# EAGLE board OpenBook_Reader (EAGLE 9.7.0)
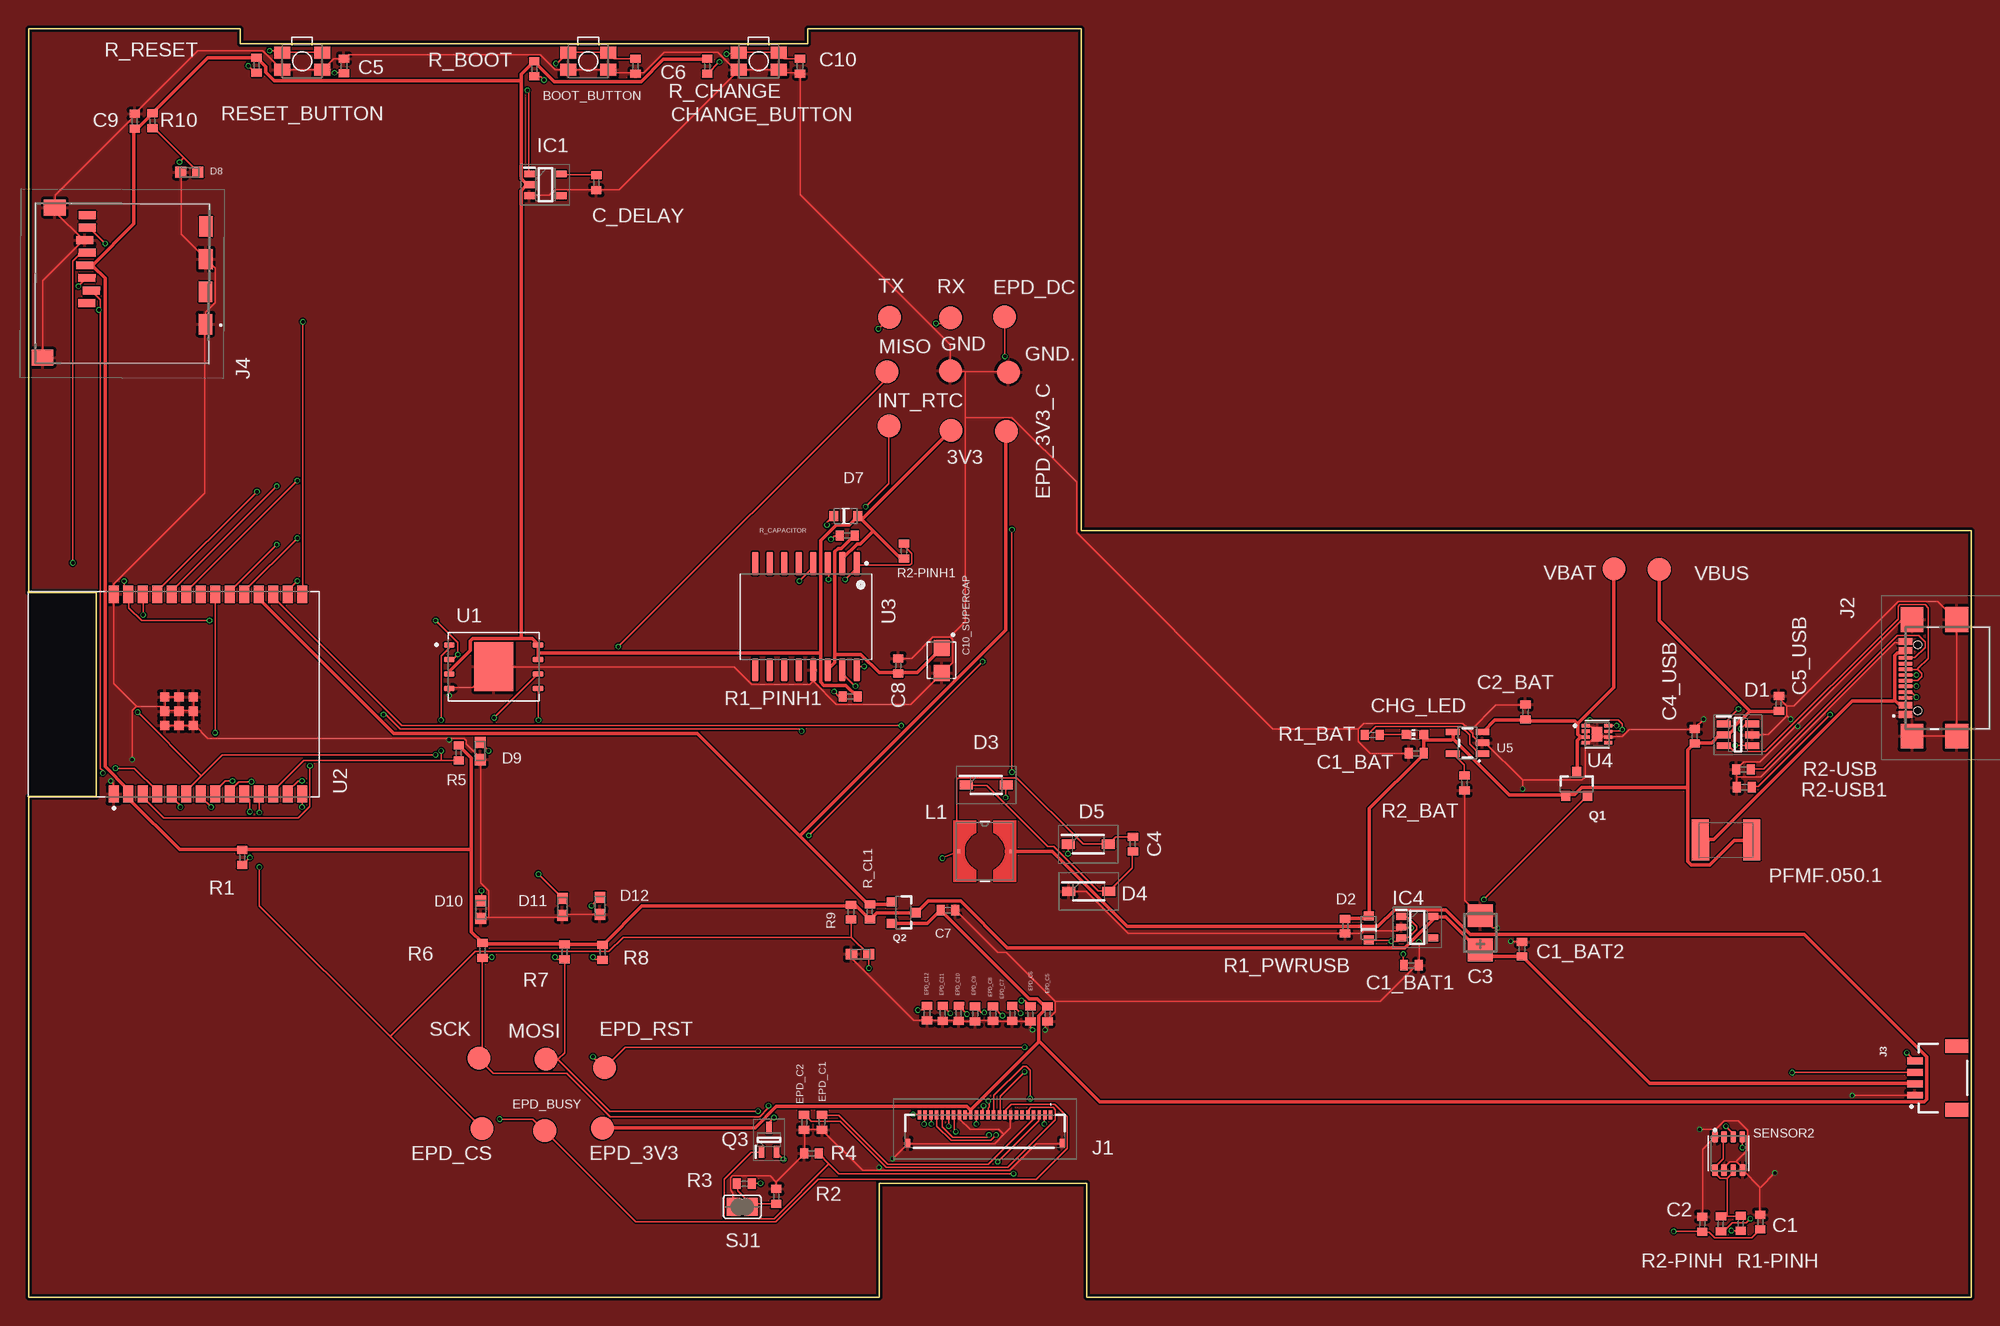
[diagram p1: board, top side]
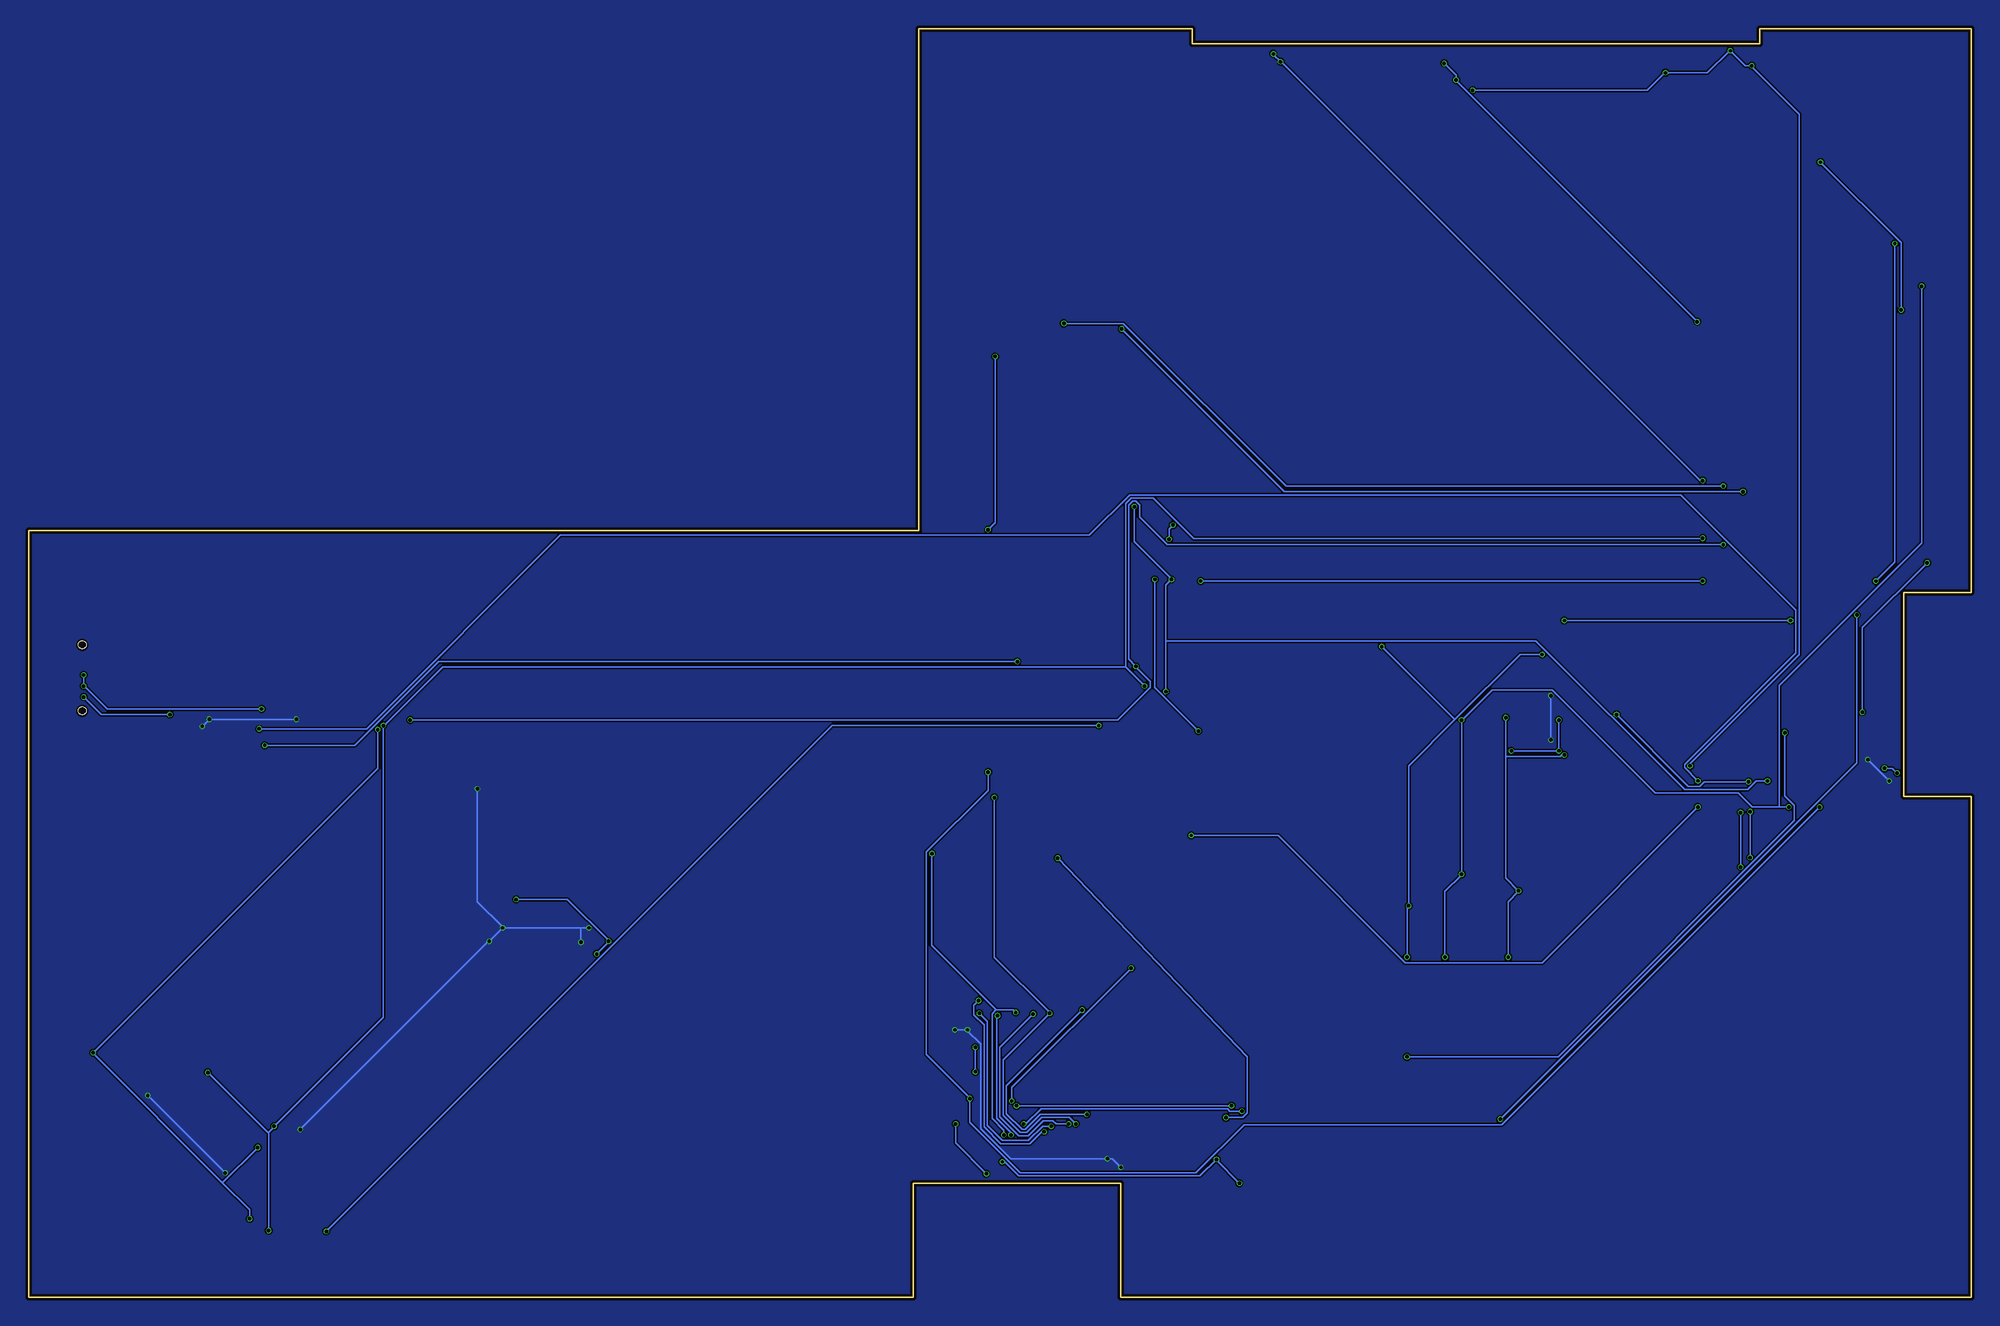
[diagram p2: board, bottom side, seen from below]

Size 170.2 x 111.2 mm. Coordinates in mm from the lower left corner, seen from the top.
Outline: 0,111.2 0,61.76 5.95,61.76 5.95,43.89 0,43.89 0,0 74.52,0 74.52,10 92.72,10 92.72,0 170.2,0 170.2,67.2 92.2,67.2 92.2,111.2 68.28,111.2 68.28,109.88 18.55,109.88 18.55,111.2 0,111.2
Copper layers (1*16): Top 0.035mm / dielectric 1.6mm / Bottom 0.035mm
Design rules "jlcpcb-2layers.dru *": minimum track width 0.15mm, minimum drill 0.3mm, track to track 5mil, track to pad 5mil, pad to pad 5mil, via to via 5mil, smd to smd 5mil, copper to edge 0.2mm, drill to drill 6mil, minimum pad ring 10mil, minimum via ring 3mil, stop-mask expansion 4mil, vias tented up to drill 0mil, thermal gap 10mil
Net classes: 1 Power: width 0.3 mm

## Footprints (pad centres in the part's own frame; a part is rotated, then mirrored left to right if it is on the bottom)
TP20R = smd 2 x 2: TP 0,0
MYBUTTON = smd 1.4 x 1.05: 1 1.75,0.75; 2 -1.75,0.75; 3 -1.75,-0.75; 4 1.75,-0.75
EAGLE-LTSPICE_C0402 = smd 0.7 x 0.9: 1 -0.65,0; 2 0.65,0
RCL_CT3528 = smd 2 x 2.2: + -1.5,0; - 1.5,0
CAPCP3225X100N = smd 1.4 x 1.4: 1 -1.1,0; 2 1.1,0
ADAFRUIT_CHIP-LED0603 = smd 0.8 x 0.8: A 0,-0.75; C 0,0.75
SOT95P280X145-6N = smd 1.2 x 0.6: 1 -1.25,0.95; 2 -1.25,0; 3 -1.25,-0.95; 4 1.25,-0.95; 5 1.25,0; 6 1.25,0.95
ESP32_WROVER_AVX---SD0805S020S1R0_AVX_SD0805S020S1R0_0 = smd 0.8 x 0.9: 1 -1.05,0; 2 1.05,0
SOD3716X135N = smd 1.15 x 0.8: 1 -1.75,0; 2 1.75,0
DIOC1608X36N = smd 0.97 x 0.94: 1 -0.75,0; 2 0.75,0
SOT95P280X125-5N = smd 0.9 x 0.6: 1 -1.4,0.95; 2 -1.4,0; 3 -1.4,-0.95; 4 1.4,-0.95; 5 1.4,0.95
SOT95P280X120-5N = smd 0.9 x 0.6: 1 -1.4,0.95; 2 -1.4,0; 3 -1.4,-0.95; 4 1.4,-0.95; 5 1.4,0.95
FH34SRJ24S05SH99 = smd 0.3 x 0.8: 1 5.75,1.45; 2 5.25,1.45; 3 4.75,1.45; 4 4.25,1.45; 5 3.75,1.45; 6 3.25,1.45; 7 2.75,1.45; 8 2.25,1.45; 9 1.75,1.45; 10 1.25,1.45; 11 0.75,1.45; 12 0.25,1.45; 13 -0.25,1.45; 14 -0.75,1.45; 15 -1.25,1.45; 16 -1.75,1.45; 17 -2.25,1.45; 18 -2.75,1.45; 19 -3.25,1.45; 20 -3.75,1.45; 21 -4.25,1.45; 22 -4.75,1.45; 23 -5.25,1.45; 24 -5.75,1.45 | smd 0.4 x 0.8: MP1 6.75,-1.05; MP2 -6.75,-1.05
SAMACSYS_PARTS_USB4110GFA = smd 0.3 x 1.15: A1 -3.35,3.678; A4 -2.55,3.678; A5 -1.25,3.678; A6 -0.25,3.678; A7 0.25,3.678; A8 1.25,3.678; A9 2.55,3.678; A12 3.35,3.678; B1 3.05,3.678; B4 2.25,3.678; B5 1.75,3.678; B6 0.75,3.678; B7 -0.75,3.678; B8 -1.75,3.678; B9 -2.25,3.678; B12 -3.05,3.678 | smd 2.18 x 2: MP1 -5.11,-0.827; MP2 5.11,-0.827; MP3 -5.11,3.103; MP4 5.11,3.103 | hole 0.65: -2.89,2.603; 2.89,2.603
JST04_1MM_RA = smd 0.6 x 1.35: 1 -1.5,0; 2 -0.5,0; 3 0.5,0; 4 1.5,0 | smd 1.2 x 2: NC1 2.8,-3.675; NC2 -2.8,-3.675
112ATAARR03ATTEND = smd 1.8 x 1.2: G1 10.6,10.4; G2 4.9,10.4; S1 7.75,10.4; S2 2.05,10.4 | smd 1.4 x 1.9: G3 13.6,-3.85; G4 0.45,-2.85 | smd 0.7 x 1.5: P1 8.8,0; P2 7.7,0.4; P3 6.6,0; P4 5.5,-0.2; P5 4.4,0; P6 3.3,-0.2; P7 2.2,0; P8 1.1,0
IND_4828-WE-TPC_WRE = smd 0.305 x 0.305: 1 -2.286,0; 2 2.286,0
ESP32C6_VARISTOR_CT/CN1812 = smd 1.5 x 3.6: 1 -2.25,0; 2 2.25,0
ESP32_WROVER_SPARKFUN-DISCRETESEMI_SOT23-3 = smd 0.8 x 0.9: 1 -0.95,-1; 2 0.95,-1; 3 0,1.1
SOT65P210X110-3N = smd 1.05 x 0.5: 1 -1.05,0.65; 2 -1.05,-0.65; 3 1.05,0
ESP32_WROVER_EAGLE-LTSPICE_R0402 = smd 0.7 x 0.9: 1 -0.65,0; 2 0.65,0
ESP32_WROVER_BME680_PSON80P300X300X100-8N = smd 1.016 x 0.5: 1 1.458,1.2; 2 1.458,0.4; 3 1.458,-0.4; 4 1.458,-1.2; 5 -1.458,-1.22; 6 -1.458,-0.4; 7 -1.458,0.4; 8 -1.458,1.2
SJ = smd 1.168 x 1.6: 1 -0.762,0; 2 0.762,0
SON127P600X800X80-9N = smd 0.94 x 0.44: 1 -3.895,1.905; 2 -3.895,0.635; 3 -3.895,-0.635; 4 -3.895,-1.905; 5 3.895,-1.905; 6 3.895,-0.635; 7 3.895,0.635; 8 3.895,1.905 | smd 3.4 x 4.3: 9 0,0
XCVR_ESP32-C6-WROOM-1-N8 = smd 1.5 x 0.9: 1 -8.75,5.26; 2 -8.75,3.99; 3 -8.75,2.72; 4 -8.75,1.45; 5 -8.75,0.18; 6 -8.75,-1.09; 7 -8.75,-2.36; 8 -8.75,-3.63; 9 -8.75,-4.9; 10 -8.75,-6.17; 11 -8.75,-7.44; 12 -8.75,-8.71; 13 -8.75,-9.98; 14 -8.75,-11.25; 15 8.75,-11.25; 16 8.75,-9.98; 17 8.75,-8.71; 18 8.75,-7.44; 19 8.75,-6.17; 20 8.75,-4.9; 21 8.75,-3.63; 22 8.75,-2.36; 23 8.75,-1.09; 24 8.75,0.18; 25 8.75,1.45; 26 8.75,2.72; 27 8.75,3.99; 28 8.75,5.26 | smd 0.8 x 0.8: 29_1 -2.755,0.79; 29_2 -1.505,0.79; 29_3 -0.255,0.79; 29_4 -2.755,-0.46; 29_5 -1.505,-0.46; 29_6 -0.255,-0.46; 29_7 -2.755,-1.71; 29_8 -1.505,-1.71; 29_9 -0.255,-1.71
SOIC127P1032X265-16N = smd 2.05 x 0.59: 1 -4.655,4.445; 2 -4.655,3.175; 3 -4.655,1.905; 4 -4.655,0.635; 5 -4.655,-0.635; 6 -4.655,-1.905; 7 -4.655,-3.175; 8 -4.655,-4.445; 9 4.655,-4.445; 10 4.655,-3.175; 11 4.655,-1.905; 12 4.655,-0.635; 13 4.655,0.635; 14 4.655,1.905; 15 4.655,3.175; 16 4.655,4.445
SON50P200X200X80-9N = smd 0.76 x 0.27: 1 -0.985,0.75; 4 -0.985,-0.75; 5 0.985,-0.75; 6 0.985,-0.25; 7 0.985,0.25; 8 0.985,0.75 | smd 0.76 x 0.3: 2 -0.985,0.25; 3 -0.985,-0.25 | smd 0.9 x 1.3: 9 0,0
ESP32_WROVER_SPARKFUN-IC-POWER_SOT23-5 = smd 0.55 x 1.2: 1 -0.95,-1.3; 2 0,-1.3; 3 0.95,-1.3; 4 0.95,1.3; 5 -0.95,1.3

## Placement (x,y rotation side)
3V3  TPTP20R  [TP20R]  80.81,75.97 0 top
BOOT_BUTTON  BUTTON_CUSYOMV1  [MYBUTTON]  49.03,108.32 180 top
C1  100nF  [EAGLE-LTSPICE_C0402]  151.69,6.61 90 top
C1_BAT  4.7uF  [EAGLE-LTSPICE_C0402]  121.57,47.69 180 top
C1_BAT1  4.7uF  [EAGLE-LTSPICE_C0402]  121.14,29.12 0 top
C1_BAT2  4.7uF  [EAGLE-LTSPICE_C0402]  130.83,30.52 90 top
C2  100nF  [EAGLE-LTSPICE_C0402]  146.61,6.43 90 top
C2_BAT  4.7uF  [EAGLE-LTSPICE_C0402]  131.13,51.3 90 top
C3  100uF TANT  [RCL_CT3528]  127.17,31.96 90 top
C4  4.7uF/25V  [EAGLE-LTSPICE_C0402]  96.74,39.73 90 top
C4_USB  100nF  [EAGLE-LTSPICE_C0402]  145.96,49.19 90 top
C5  1uF  [EAGLE-LTSPICE_C0402]  27.63,107.92 90 top
C5_USB  4.7uF  [EAGLE-LTSPICE_C0402]  153.33,52.05 90 top
C6  100nF  [EAGLE-LTSPICE_C0402]  53.17,107.89 270 top
C7  10uF  [EAGLE-LTSPICE_C0402]  80.54,33.95 0 top
C8  100nF  [EAGLE-LTSPICE_C0402]  76.18,55.34 90 top
C9  100nF  [EAGLE-LTSPICE_C0402]  9.31,103.08 90 top
C10  100nF  [EAGLE-LTSPICE_C0402]  67.58,107.89 270 top
C10_SUPERCAP  CPH3225A  [CAPCP3225X100N]  79.99,55.83 270 top
C_DELAY  100nF  [EAGLE-LTSPICE_C0402]  49.74,97.69 269.6 top
CHANGE_BUTTON  BUTTON_CUSYOMV1  [MYBUTTON]  63.96,108.32 180 top
CHG_LED  [ADAFRUIT_CHIP-LED0603]  121.46,49.34 90 top
D1  USBLC6-2SC6Y  [SOT95P280X145-6N]  149.75,49.3 0 top
D2  ESP32_WROVER_AVX---SD0805S020S1R0_AVX_SD0805S020S1R0_0_0AVX_SD0805S020S1R0_0_0  [ESP32_WROVER_AVX---SD0805S020S1R0_AVX_SD0805S020S1R0_0]  117.4,32.39 90 top
D3  MBR0530  [SOD3716X135N]  83.89,44.91 0 top
D4  MBR0530  [SOD3716X135N]  92.88,35.59 0 top
D5  MBR0530  [SOD3716X135N]  92.83,39.73 0 top
D6  PGB1010603MR  [DIOC1608X36N]  72.84,30.09 0 top
D7  ESP32_WROVER_AVX---SD0805S020S1R0_AVX_SD0805S020S1R0_0_0AVX_SD0805S020S1R0_0_0  [ESP32_WROVER_AVX---SD0805S020S1R0_AVX_SD0805S020S1R0_0]  71.6,68.47 0 top
D8  PGB1010603MR  [DIOC1608X36N]  14.07,98.61 0 top
D9  PGB1010603MR  [DIOC1608X36N]  39.56,47.88 90 top
D10  PGB1010603MR  [DIOC1608X36N]  39.61,33.98 90 top
D11  PGB1010603MR  [DIOC1608X36N]  46.77,34.23 90 top
D12  PGB1010603MR  [DIOC1608X36N]  50.05,34.33 90 top
EPD_3V3  TPTP20R  [TP20R]  50.26,14.83 0 top
EPD_3V3_C  TPTP20R  [TP20R]  85.65,75.91 0 top
EPD_BUSY  TPTP20R  [TP20R]  45.22,14.62 0 top
EPD_C1  1uF/50V  [EAGLE-LTSPICE_C0402]  69.51,15.36 90 top
EPD_C2  1uF/50V  [EAGLE-LTSPICE_C0402]  67.94,15.36 90 top
EPD_C5  1uF/50V  [EAGLE-LTSPICE_C0402]  89.27,24.86 90 top
EPD_C6  1uF/50V  [EAGLE-LTSPICE_C0402]  87.76,24.84 90 top
EPD_C7  1uF/50V  [EAGLE-LTSPICE_C0402]  86.17,24.88 90 top
EPD_C8  1uF/50V  [EAGLE-LTSPICE_C0402]  84.49,24.88 90 top
EPD_C9  1uF/50V  [EAGLE-LTSPICE_C0402]  82.92,24.87 90 top
EPD_C10  1uF/50V  [EAGLE-LTSPICE_C0402]  81.49,24.9 89.2 top
EPD_C11  1uF/50V  [EAGLE-LTSPICE_C0402]  80.08,24.91 90 top
EPD_C12  1uF/50V  [EAGLE-LTSPICE_C0402]  78.71,24.91 90 top
EPD_CS  TPTP20R  [TP20R]  39.71,14.8 0 top
EPD_DC  TPTP20R  [TP20R]  85.51,85.95 0 top
EPD_RST  TPTP20R  [TP20R]  50.46,20.12 0 top
GND  TPTP20R  [TP20R]  80.76,81.22 0 top
GND.  TPTP20R  [TP20R]  85.84,81.08 0 top
IC1  BD5229G-TR  [SOT95P280X125-5N]  45.28,97.5 0 top
IC4  XC6220A331MR-G  [SOT95P280X120-5N]  121.65,32.45 0 top
INT_RTC  TPTP20R  [TP20R]  75.39,76.38 0 top
J1  FH34SRJ-24S-0.5SH_99_  [FH34SRJ24S05SH99]  83.79,14.55 0 top
J2  SAMACSYS_PARTS_USB4110-GF-A  [SAMACSYS_PARTS_USB4110GFA]  168.1,54.3 90 top
J3  QWIIC_RIGHT_ANGLE  [JST04_1MM_RA]  165.25,19.23 90 top
J4  112A-TAAR-R03_ATTEND  [112ATAARR03ATTEND]  5.15,95.95 269.7 top
L1  744043680IND_4828-WE-TPC_WRE  [IND_4828-WE-TPC_WRE]  83.77,39.11 0 top
MISO  TPTP20R  [TP20R]  75.22,81.12 0 top
MOSI  TPTP20R  [TP20R]  45.32,20.89 0 top
PFMF.050.1  ESP32C6_VARISTORCN1812  [ESP32C6_VARISTOR_CT/CN1812]  148.7,40.09 0.3 top
Q1  20V/4.2A/52mΩ/1.4W  [ESP32_WROVER_SPARKFUN-DISCRETESEMI_SOT23-3]  135.62,44.95 0 top
Q2  20V/4.2A/52mΩ/1.4W  [ESP32_WROVER_SPARKFUN-DISCRETESEMI_SOT23-3]  76.61,33.73 270 top
Q3  SI1308EDL-T1-GE3  [SOT65P210X110-3N]  64.86,13.82 90 top
R1  10K  [ESP32_WROVER_EAGLE-LTSPICE_R0402]  18.73,38.55 90 top
R1-PINH  10K  [ESP32_WROVER_EAGLE-LTSPICE_R0402]  149.98,6.5 90 top
R1_BAT  200  [ESP32_WROVER_EAGLE-LTSPICE_R0402]  117.71,49.29 0 top
R1_PINH1  10K  [ESP32_WROVER_EAGLE-LTSPICE_R0402]  71.97,52.66 0 top
R1_PWRUSB  100K  [ESP32_WROVER_EAGLE-LTSPICE_R0402]  115.33,32.53 90 top
R2  2.2  [ESP32_WROVER_EAGLE-LTSPICE_R0402]  65.5,8.86 270 top
R2-PINH  10K  [ESP32_WROVER_EAGLE-LTSPICE_R0402]  148.25,6.45 90 top
R2-PINH1  10K  [ESP32_WROVER_EAGLE-LTSPICE_R0402]  76.69,65.42 270 top
R2-USB  5K1  [ESP32_WROVER_EAGLE-LTSPICE_R0402]  150.23,46.28 180 top
R2-USB1  5k1  [ESP32_WROVER_EAGLE-LTSPICE_R0402]  150.31,44.72 0 top
R2_BAT  2K  [ESP32_WROVER_EAGLE-LTSPICE_R0402]  125.79,45.08 90 top
R3  0.47  [ESP32_WROVER_EAGLE-LTSPICE_R0402]  62.71,9.98 180 top
R4  10K  [ESP32_WROVER_EAGLE-LTSPICE_R0402]  68.59,12.62 180 top
R5  10K  [ESP32_WROVER_EAGLE-LTSPICE_R0402]  37.69,47.72 90 top
R6  10K  [ESP32_WROVER_EAGLE-LTSPICE_R0402]  39.77,30.41 90 top
R7  10K  [ESP32_WROVER_EAGLE-LTSPICE_R0402]  46.96,30.29 90 top
R8  10K  [ESP32_WROVER_EAGLE-LTSPICE_R0402]  50.29,30.25 90 top
R9  10K  [ESP32_WROVER_EAGLE-LTSPICE_R0402]  72.05,33.77 90 top
R10  10K  [ESP32_WROVER_EAGLE-LTSPICE_R0402]  10.85,103.11 90 top
R_BOOT  10K  [ESP32_WROVER_EAGLE-LTSPICE_R0402]  44.3,107.67 270 top
R_CAPACITOR  15  [ESP32_WROVER_EAGLE-LTSPICE_R0402]  71.71,66.78 0 top
R_CHANGE  10K  [ESP32_WROVER_EAGLE-LTSPICE_R0402]  59.46,107.89 270 top
R_CL1  10K  [ESP32_WROVER_EAGLE-LTSPICE_R0402]  73.7,33.8 90 top
R_RESET  10K  [ESP32_WROVER_EAGLE-LTSPICE_R0402]  19.98,107.98 270 top
RESET_BUTTON  BUTTON_CUSYOMV1  [MYBUTTON]  23.97,108.32 180 top
RX  TPTP20R  [TP20R]  80.77,85.84 0 top
SCK  TPTP20R  [TP20R]  39.45,20.96 0 top
SENSOR2  ESP32_WROVER_BME680_BME680  [ESP32_WROVER_BME680_PSON80P300X300X100-8N]  148.93,12.62 90 top
SJ1  [SJ]  62.52,7.95 0 top
TX  TPTP20R  [TP20R]  75.43,85.89 0 top
U1  W25Q512JVEIQ  [SON127P600X800X80-9N]  40.75,55.27 0 top
U2  ESP32-C6-WROOM-1-N8  [XCVR_ESP32-C6-WROOM-1-N8]  12.72,52.88 90 top
U3  DS3231SN#  [SOIC127P1032X265-16N]  68.1,59.66 270 top
U4  MAX17048G+T10  [SON50P200X200X80-9N]  137.4,49.36 0 top
U5  ESP32_WROVER_SPARKFUN-IC-POWER_MCP73831  [ESP32_WROVER_SPARKFUN-IC-POWER_SOT23-5]  126.06,48.61 90 top
VBAT  TPTP20R  [TP20R]  138.89,63.84 0 top
VBUS  TPTP20R  [TP20R]  142.85,63.8 0 top

## Tracks (layer width: path | path; a pad name or v marks a point on that pad's centre or on a via)
3V3
  Top 0.3: 43.14,57.73 44.11,57.73 44.6,57.25 U1.8 44.67,57.04 44.67,56.48 | 43.14,57.73 38.92,57.73 38.71,57.52 38.71,56.69 36.91,54.89 36.91,54.68 U1.3 | 44.67,56.48 44.67,55.93 U1.7 | 69.39,56.48 69.39,66.32 70.77,67.7 71.88,67.7 72.64,68.46 D7.2 72.78,68.4 72.99,68.19 | 69.39,56.48 69.39,53.92 69.67,53.65 71.61,53.65 72.57,52.67 R1_PINH1.2 | 72.99,68.19 73.99,67.18 | 73.99,67.18 76.38,64.79 76.66,64.79 R2-PINH1.2 | 72.99,68.19 80.75,75.94 3V3.TP | 73.99,67.18 72.85,66.04 72.57,66.04 71.33,64.79 71.33,64.38 U3.2 | 69.39,56.48 44.67,56.48 | 43.14,106.62 43.14,107.17 44.25,108.28 R_BOOT.1 44.39,108.21 46.05,106.55 53.67,106.55 55.61,108.49 59.42,108.49 R_CHANGE.1 | 43.14,106.62 43.14,98.03 43.63,97.55 43.84,97.55 IC1.2 43.56,97.41 43.14,97 43.14,57.73 | 5.61,90.49 4.99,90.49 J4.P4 | 5.61,90.49 9.21,94.09 9.21,102.33 C9.1 9.35,102.47 9.56,102.47 10.8,103.71 R10.2 10.94,103.85 15.72,108.63 19.94,108.63 R_RESET.1 20.08,108.56 20.77,107.87 20.77,107.38 21.54,106.62 43.14,106.62 | J3.2 165.23,18.74 142.03,18.74 130.95,29.82 C1_BAT2.1 130.81,29.89 127.77,29.89 127.28,30.38 C3.+ 127.14,30.52 127,30.52 124.17,33.36 123.06,33.36 IC4.5 122.99,33.22 122.99,33.08 120.56,30.65 85.73,30.65 81.65,34.74 78.81,34.74 77.84,33.77 Q2.3 77.7,33.7 74.31,33.7 73.82,33.22 R_CL1.1 73.68,33.15 72.44,34.39 72.09,34.39 R9.2 71.95,34.32 53.74,34.32 50.41,31 R8.2 50.28,30.93 47.02,30.93 R7.2 46.88,31 39.82,31 R6.2 39.68,31.14 38.78,32.04 38.78,39.24 | 38.78,39.24 38.78,47.27 37.74,48.31 R5.2 | 38.78,39.24 18.84,39.24 R1.2 18.7,39.24 13.23,39.24 8.79,43.67 8.79,44.09 U2.2 8.66,44.23 8.66,44.57 6.72,46.51 6.72,89.31 5.68,90.35 5.61,90.49
12C_PW
  Top 0.15: 148.82,7.11 149.93,7.11 R1-PINH.2 | 148.82,7.11 148.26,7.11 R2-PINH.2 | 148.82,10.43 148.19,10.43 147.78,10.85 147.78,11.12 SENSOR2.8 147.78,11.19 147.78,11.47 148.47,12.16 148.47,14.03 SENSOR2.2 | 148.82,10.43 149.3,10.92 149.3,11.12 SENSOR2.6 | 148.82,10.43 148.82,7.11
32KHZ  (via drill 0.3)
  Top 0.15: R2-PINH1.1 76.73,66.04 76.73,65.83 77.35,65.21 77.35,64.31 77.21,64.17 72.71,64.17 72.57,64.31 U3.1 72.71,64.1 v71.53,62.92 | v19.53,45.2 18.42,45.2 17.66,44.43 17.66,44.16 U2.9 | v31.09,51.08 31.3,51.08 32.55,49.84 67.52,49.84 v67.73,49.63
  Bottom 0.15: v19.53,45.2 23.41,45.2 23.82,44.78 24.79,44.78 v31.09,51.08 | v67.73,49.63 71.53,53.44 v71.53,62.92
DN  (via drill 0.3)
  Top 0.15: v165.37,53.58 164.47,53.58 J2.B7 | J2.A7 v165.37,54.55 | v149.79,51.57 148.54,50.32 D1.1
  Bottom 0.15: v165.37,54.55 v165.37,53.58 165.3,53.58 163.29,51.57 v149.79,51.57
DP
  Top 0.15: 165.51,55.03 165.85,54.68 165.85,54.41 165.51,54.06 164.47,54.06 J2.A6 | 165.51,55.03 164.47,55.03 J2.B6 | D1.3 148.54,48.31 148.96,48.31 149.44,47.83 152.14,47.83 163.78,59.46 163.78,60.57 163.91,60.71 166.13,60.71 166.41,60.43 166.41,56 165.51,55.1 165.51,55.03
EPD_3V3
  Top 0.3: Q2.2 75.62,32.8 78.74,32.8 79.84,33.91 C7.1 79.98,33.84 87.67,26.15 88.36,26.15 89.06,25.46 EPD_C5.2 89.26,25.46 88.5,24.7 88.5,22.41 | J1.16 82.06,16.04 82.48,16.04 J1.15 82.55,16.18 82.55,16.46 | 82.55,16.46 88.5,22.41 | EPD_3V3.TP 50.28,14.87 63.64,14.87 65.51,16.73 82.2,16.73 82.41,16.53 82.55,16.46 | L1.2 86.08,39.1 89.68,39.1 96.26,32.52 118.21,32.52 119.66,33.98 124.17,33.98 126.31,31.83 155.54,31.83 166.27,21.1 166.27,17.36 166.06,17.15 93.83,17.15 88.64,22.34 88.5,22.41
EPD_3V3_C
  Top 0.3: Q2.1 75.55,34.67 75.34,34.46 73.75,34.46 R_CL1.2 73.54,34.46 67.55,40.45 | 67.55,40.45 58.59,49.42 31.99,49.42 20.22,61.19 20.22,61.61 U2.18 | 67.55,40.45 85.59,58.49 85.59,75.87 EPD_3V3_C.TP
EPD_BUSY  (via drill 0.3)
  Top 0.15: J1.9 85.59,16.04 85.59,16.46 86.08,16.94 89.89,16.94 91,15.83 91,13.06 88.29,10.36 69.18,10.36 65.44,6.62 53.18,6.62 45.22,14.59 EPD_BUSY.TP 45.15,14.66 44.18,15.63 v41.27,15.63 | v10.04,59.81 10.04,61.61 U2.26
  Bottom 0.15: v10.04,59.81 10.04,46.86 v41.27,15.63
EPD_CS  (via drill 0.3)
  Top 0.15: v84.07,17.22 84.14,17.15 84.14,16.66 84.07,16.6 84.07,16.04 J1.12 | v73.61,28.85 73.61,30.03 D6.2 73.54,30.1 72.09,31.55 | 72.09,31.55 72.09,33.08 R9.1 | v20.22,42.5 20.22,44.09 U2.11 | v20.22,37.72 20.22,34.32 31.68,22.86 | 31.68,22.86 39.68,14.87 EPD_CS.TP | 72.09,31.55 52.08,31.55 50.83,30.31 39.13,30.31 31.68,22.86
  Bottom 0.15: v84.07,17.22 84.07,18.4 v73.61,28.85 | v20.22,37.72 v20.22,42.5
EPD_DC  (via drill 0.3)
  Top 0.15: v87.74,17.43 87.74,19.92 87.39,20.27 87.12,20.27 84.55,17.7 84.55,16.04 J1.11 | v13.3,42.98 13.3,43.12 12.6,43.81 12.6,44.09 U2.5 | v85.52,82.45 85.52,85.92 EPD_DC.TP | v86.15,46.03 v86.15,67.29
  Bottom 0.15: v13.3,42.98 41.13,15.14 63.71,15.14 67.93,10.92 83.31,10.92 87.74,15.35 v87.74,17.43 87.74,17.5 91.55,21.3 91.55,39.03 86.15,44.43 v86.15,46.03 | v85.52,82.45 85.52,67.91 v86.15,67.29
EPD_RST  (via drill 0.3)
  Top 0.15: v87.25,19.78 85.11,17.64 85.11,16.04 J1.10 | v87.25,21.93 52.28,21.93 50.48,20.13 EPD_RST.TP 50.41,20.13 v49.44,21.1 | v16.34,49.49 16.34,61.61 U2.21
  Bottom 0.15: v87.25,21.93 v87.25,19.78 | v16.34,49.49 16.34,43.95 15.51,43.12 15.51,41.8 36.22,21.1 v49.44,21.1
FLASH_CS  (via drill 0.3)
  Top 0.15: 36.15,47.07 24.1,47.07 21.47,44.43 21.47,44.16 U2.12 | 36.15,47.07 37.67,47.07 R5.1 | v36.15,50.6 36.15,56.21 36.84,56.9 U1.1 | 36.15,47.07 v36.15,47.9 | v40.3,47.9 39.61,48.59 D9.2
  Bottom 0.15: v36.15,50.6 v36.15,47.9 v40.3,47.9
GDR  (via drill 0.3)
  Top 0.15: v88.99,15.21 88.99,15.97 J1.2 | v86.28,10.85 70.98,10.85 70.12,11.71 | 70.12,11.71 69.25,12.58 R4.1 | 70.12,11.71 65.3,6.9 61.08,6.9 60.94,7.04 60.94,10.36 63.29,12.72 64.19,12.72 Q3.1
  Bottom 0.15: v88.99,15.21 88.99,13.55 v86.28,10.85
GND  (via drill 0.3)
  Top 0.15: 40.3,33.28 46.6,33.28 46.74,33.42 D11.1 46.81,33.49 46.88,33.56 50,33.56 D12.1 | 40.3,33.28 39.61,33.28 D10.1 | 40.3,33.28 40.3,35.64 39.61,36.33 39.61,47.07 D9.1 39.54,47.14 39.54,47.34 38.36,48.52 38.36,48.8 38.16,49.01 36.84,49.01 | D8.1 13.37,98.59 13.37,93.19 15.51,91.04 J4.G2 15.58,90.97 16.34,90.21 16.34,87.16 15.51,86.33 15.51,85.29 J4.G1 15.44,85.22 15.44,70.47 7.48,62.51 7.48,61.68 U2.28 7.48,61.61 7.48,53.78 9.42,51.84 9.42,51.77 | U2.29_1 11.98,50.11 13.16,50.11 U2.29_4 13.23,50.11 14.4,50.11 U2.29_7 | U2.29_8 14.47,51.43 14.47,52.61 U2.29_9 | 11.98,51.77 11.98,52.61 U2.29_3 12.05,52.61 13.16,52.61 U2.29_6 | 11.98,51.77 11.98,51.43 U2.29_2 12.05,51.43 13.16,51.43 U2.29_5 13.23,51.43 14.4,51.43 U2.29_8 | v7.2,45.27 7.41,45.06 7.41,44.16 U2.1 | v9.07,47.14 9.07,51.43 9.42,51.77 | 11.98,51.77 9.42,51.77 | U2.29_7 14.47,50.18 14.47,51.36 U2.29_8 | 36.84,49.01 15.72,49.01 14.54,50.18 U2.29_7 | 82.06,81.14 80.88,81.14 80.81,81.21 GND.TP 80.75,81.28 80.75,83.49 67.59,96.65 67.59,107.17 C10.2 67.52,107.31 65.93,107.31 65.72,107.52 CHANGE_BUTTON.2 65.65,107.59 62.26,107.59 CHANGE_BUTTON.1 | 82.06,81.14 85.8,81.14 GND..TP | 80.75,57.87 79.22,57.87 77.35,56 76.24,56 C8.2 | 80.75,57.87 80.95,57.66 80.95,55.65 80.05,54.75 C10_SUPERCAP.2 79.98,54.68 77.28,51.98 70.77,51.98 68.77,53.99 68.77,54.96 U3.13 68.7,53.99 68.42,53.71 63.36,53.71 61.84,55.24 40.79,55.24 U1.9 40.72,55.24 38.92,53.44 36.91,53.44 U1.4 36.84,53.3 v36.84,52.74 | 82.06,77.12 82.06,59.25 80.75,57.94 80.75,57.87 | 82.06,77.12 82.06,81.14 | IC1.3 43.9,96.58 45.64,96.58 46.12,97.06 49.72,97.06 C_DELAY.2 49.79,97.06 51.73,97.06 62.19,107.52 CHANGE_BUTTON.1
  Top 0.15: CHANGE_BUTTON.1 62.05,107.45 60.39,109.11 55.68,109.11 53.88,107.31 53.18,107.31 C6.2 53.12,107.31 51.04,107.31 50.83,107.52 BOOT_BUTTON.2 50.76,107.59 47.3,107.59 BOOT_BUTTON.1 47.23,107.59 46.12,107.59 44.8,108.91 28.05,108.91 27.7,108.56 C5.2 27.56,108.56 26.73,108.56 25.76,107.59 RESET_BUTTON.2 25.69,107.59 22.23,107.59 RESET_BUTTON.1 22.16,107.59 20.5,109.25 14.82,109.25 9.35,103.78 C9.2 9.28,103.71 9.28,103.5 2.35,96.58 2.35,95.54 J4.G4 2.35,95.47 2.35,95.13 4.78,92.7 4.92,92.7 J4.P6 4.78,92.63 1.25,89.1 1.25,82.38 J4.G3 | v36.84,48.87 36.84,49.01 | 65.51,10.16 65.51,9.53 R2.1 | 65.51,10.16 67.93,12.58 R4.2 68,12.65 68,14.66 EPD_C2.1 68,14.73 69.46,14.73 EPD_C1.1 69.53,14.66 73.06,11.12 74.51,11.12 | SJ1.1 61.7,8.01 61.7,9.19 61.49,9.39 61.49,10.5 61.63,10.64 64.96,10.64 65.44,10.16 65.51,10.16 | 85.42,14.28 86.01,14.87 86.01,15.97 J1.8 | 85.42,14.28 84.62,13.48 77.08,13.48 J1.MP2 77.01,13.48 v75.69,12.16 | 85.42,14.28 84.97,14.73 82.48,14.73 81.58,15.63 81.58,15.97 J1.17 | 74.51,11.12 85.94,11.12 88.29,13.48 90.51,13.48 J1.MP1 | 74.51,11.12 v74.51,11.4 | D6.1 72.16,30.03 72.16,29.68 77.56,24.28 78.67,24.28 EPD_C12.1 78.74,24.28 80.05,24.28 EPD_C11.1 80.12,24.28 81.44,24.28 EPD_C10.1 81.51,24.21 82.89,24.21 EPD_C9.1 82.96,24.28 84.48,24.28 EPD_C8.1 84.55,24.21 86.15,24.21 EPD_C7.1 86.22,24.21 87.74,24.21 EPD_C6.1 87.81,24.14 87.81,23.59 v87.95,23.45 | 89.96,25.95 89.96,25.05 89.33,24.42 89.33,24.21 EPD_C5.1 89.26,24.14 89.06,23.94 v89.06,23.45 | 89.96,25.95 85.66,30.24 84.9,30.24 81.23,33.91 C7.2 | 89.96,25.95 118.42,25.95 121.53,29.06 121.74,29.06 C1_BAT1.2 121.81,29.13 v121.81,31.14
  Top 0.15: U4.9 137.46,49.35 136.77,48.66 136.42,48.66 U4.4 136.35,48.59 136.35,45.61 136.08,45.34 130.88,45.34 | U4.1 136.42,50.04 136.84,50.04 137.46,49.42 U4.9 | U4.9 137.53,49.35 137.74,49.14 138.36,49.14 U4.6 138.43,49.14 139.61,49.14 140.23,49.77 145.91,49.77 C4_USB.2 145.98,49.91 v146.74,50.67 | 116.48,49.84 116.48,48.73 117.52,47.69 C1_BAT.2 | 116.48,49.84 116.96,50.32 125.62,50.32 126.28,49.66 | 126.28,49.66 126.52,49.42 126.52,49.21 127.07,48.66 127.35,48.66 U5.2 127.42,48.59 127.63,48.59 130.88,45.34 | 126.28,49.66 128.53,51.91 131.09,51.91 C2_BAT.2 | 154.01,51.84 153.39,52.47 153.39,52.67 C5_USB.2 | 154.01,50.94 154.01,51.84 | 154.01,50.94 152.42,49.35 151.03,49.35 D1.5 | J2.B12 164.4,51.22 164.4,51.01 J2.A1 164.4,50.88 164.4,49.77 164.95,49.21 J2.MP3 165.02,49.21 168.9,49.21 J2.MP1 168.9,49.28 168.9,59.39 J2.MP2 168.83,59.39 167.24,60.98 163.78,60.98 154.63,51.84 154.01,51.84 | J2.A12 164.4,57.59 164.4,57.38 J2.B1 164.33,57.38 163.5,57.38 151.73,45.61 149.65,45.61 | 149.65,45.61 149.65,46.17 149.58,46.23 R2-USB.2 149.65,46.3 150.27,46.93 151.66,46.93 154.88,50.15 | 149.65,45.61 149.65,44.78 R2-USB1.1 | 154.88,50.15 164.12,59.39 164.95,59.39 J2.MP4 | v154.36,50.67 154.08,50.94 154.01,50.94 | 154.88,50.15 v154.98,50.04 | C2.2 146.67,7.11 146.67,13 147.71,14.03 SENSOR2.1 147.78,14.1 147.78,14.73 | 151.66,9.67 151.66,7.32 C1.2 | 151.66,9.67 150.2,11.12 SENSOR2.5 150.13,11.19 150.13,11.4 149.65,11.89 | 149.65,11.89 149.03,11.89 148.54,11.4 148.54,11.19 SENSOR2.7 | v159.76,17.7 165.23,17.7 J3.1 | v152.97,10.92 151.73,9.67 151.66,9.67 | 147.78,14.73 148.54,15.49 149.79,15.49 150.62,14.66 150.62,12.93 149.65,11.96 149.65,11.89
  Top 0.15: v129.84,31.21 130.81,31.21 C1_BAT2.2 | v128.67,32.39 128.25,32.39 127.21,33.42 C3.- 127.14,33.49 125.83,34.81 125.83,44.37 R2_BAT.1 | D4.1 91.13,35.57 92.66,35.57 96.33,31.9 115.3,31.9 R1_PWRUSB.1 115.37,31.9 116.75,31.9 116.96,32.11 119.94,32.11 120.22,32.39 IC4.2 120.29,32.39 v121.12,32.39 | v146.39,14.73 147.78,14.73 | v130.88,44.57 130.88,45.34 | 82.06,77.12 86.15,77.12 91.83,71.44 91.83,67.01 109,49.84 116.48,49.84
  Bottom 0.15: v9.07,47.14 v7.2,45.27 | v36.84,52.74 v36.84,48.87 | v74.51,11.4 75.28,12.16 v75.69,12.16 84.14,12.16 86.77,14.79 86.77,22.21 87.95,23.38 v87.95,23.45 v89.06,23.45 | v154.98,50.04 v154.36,50.67 v146.74,50.67 | v152.97,10.92 v159.76,17.7 | v128.67,32.39 v129.84,31.21 129.91,31.21 v146.39,14.73 | v121.12,32.39 121.81,32.39 | 121.81,32.39 v128.67,32.39 | v130.88,44.57 130.88,34.67 128.67,32.45 v128.67,32.39 | 121.81,32.39 v121.81,31.14
  pour Bottom: -15.64,-12.92 178.87,-12.92 178.87,122.91 -15.64,122.91
  pour Top: -9.26,-7.72 192.25,-7.72 192.25,117.6 -9.26,117.6
GPIO8  (via drill 0.3)
  Top 0.15: v19.39,38.55 18.77,37.92 R1.1 | v19.39,42.56 19.39,43.6 18.91,44.09 U2.10
  Bottom 0.15: v19.39,42.56 v19.39,38.55
I2C_PW  (via drill 0.3)
  Top 0.15: C1.1 151.66,5.93 150.97,5.24 147.71,5.24 147.23,5.72 146.67,5.72 C2.1 146.6,5.79 v144.11,5.79 | v76.45,50.11 32.69,50.11 21.47,61.33 21.47,61.61 U2.17
  Bottom 0.15: v76.45,50.11 99.79,50.11 v144.11,5.79
INT_RTC  (via drill 0.3)
  Top 0.15: v70.57,53.09 70.98,52.67 71.26,52.67 R1_PINH1.1 | v70.08,62.92 70.08,64.24 70.01,64.31 U3.3 | v17.87,45.27 17.24,45.27 16.41,44.43 16.41,44.16 U2.8 | v73.34,69.3 75.34,71.3 75.34,76.36 INT_RTC.TP
  Bottom 0.15: 70.57,57.52 70.57,62.44 v70.08,62.92 70.08,62.99 73.34,66.25 v73.34,69.3 | 70.57,57.52 v70.57,53.09 | v17.87,45.27 18.84,45.27 19.6,44.5 25.14,44.5 38.16,57.52 70.57,57.52
IO/BOOT  (via drill 0.3)
  Top 0.15: C6.1 53.12,108.56 51.31,108.56 50.83,109.05 BOOT_BUTTON.3 50.76,109.11 47.3,109.11 BOOT_BUTTON.4 47.23,109.05 46.33,108.14 v46.19,108.14 | v45.15,106.69 44.87,106.97 44.32,106.97 R_BOOT.2 | v24.03,85.5 24.03,61.68 U2.15
  Bottom 0.15: v46.19,108.14 45.15,107.11 v45.15,106.69 45.15,106.62 v24.03,85.5
IO/CHANGE  (via drill 0.3)
  Top 0.15: C10.1 67.52,108.56 66.2,108.56 65.72,109.05 CHANGE_BUTTON.3 65.65,109.11 62.26,109.11 CHANGE_BUTTON.4 62.19,109.05 62.12,108.97 v61.15,108.97 | v60.52,108.28 59.49,107.24 R_CHANGE.2 | v23.55,71.58 13.85,61.88 13.85,61.68 U2.23
  Bottom 0.15: v61.15,108.97 61.15,108.91 v60.52,108.28 60.45,108.28 23.75,71.58 v23.55,71.58
MISO  (via drill 0.3)
  Top 0.15: v49.44,29.82 49.65,29.62 50.28,29.62 R8.1 | v49.31,34.32 50,35.02 D12.2 | U1.2 36.91,55.93 37.19,55.93 v37.6,56.35 37.6,57.38 v35.66,59.32 | v15.86,59.32 9.9,59.32 8.79,60.43 8.79,61.61 U2.27 8.73,61.68 8.38,62.02 v8.38,62.79 | v6.72,92.36 5.33,93.74 5.19,93.74 J4.P7 | v51.66,57.04 74.94,80.32 MISO.TP
  Bottom 0.15: v49.44,29.82 49.44,34.19 v49.31,34.32 49.31,46.58 45.26,50.63 | v37.6,56.35 39.54,56.35 45.26,50.63 | v35.66,59.32 v15.86,59.32 | v6.72,92.36 6.72,64.45 v8.38,62.79 | 45.26,50.63 v51.66,57.04
MOSI  (via drill 0.3)
  Top 0.15: v83.03,15.21 83.03,15.97 J1.14 | v63.92,16.32 50.9,16.32 46.4,20.82 | 46.4,20.82 45.36,20.82 MOSI.TP | 46.4,20.82 46.4,20.89 46.95,21.44 46.95,29.62 R7.1 46.88,29.62 46.33,29.62 v46.12,29.82 | v44.67,50.6 44.67,53.37 U1.5 | v44.67,37.09 46.74,35.02 D11.2 | v16,42.98 15.1,43.88 15.1,44.09 U2.7 | v4.36,88.62 5.05,89.31 J4.P3
  Bottom 0.15: v83.03,15.21 82.82,15.21 81.51,16.53 65.16,16.53 64.96,16.32 v63.92,16.32 | 16.83,42.98 19.18,42.98 20.43,44.23 27.7,44.23 36.7,53.23 41.97,53.23 44.6,50.6 v44.67,50.6 v44.67,37.09 44.67,37.03 46.12,35.57 v46.12,29.82 | 16.83,42.98 v16,42.98 | v4.36,88.62 4.36,66.11 16.83,53.65 16.83,42.98
N$1  (via drill 0.3)
  Top 0.15: v157.82,51.08 151.52,44.78 150.97,44.78 R2-USB1.2 | v165.37,52.61 164.95,53.02 164.47,53.02 J2.A5
  Bottom 0.15: v157.82,51.08 163.84,51.08 v165.37,52.61
N$2
  Top 0.15: R2-USB.1 150.9,46.3 152,46.3 163.71,58.01 165.58,58.01 166.13,57.45 166.13,56.97 165.23,56.07 164.47,56.07 J2.B5
N$11  (via drill 0.3)
  Top 0.15: v120.43,30.1 120.43,29.13 C1_BAT1.1 | D2.1 117.45,31.28 119.39,31.28 v119.39,31.21 119.94,31.21 120.22,31.48 IC4.3 120.29,31.55 120.91,31.55 121.6,32.25 121.6,32.52 120.77,33.36 120.29,33.36 IC4.1 | v127.49,34.88 Q1.2
  Bottom 0.15: v120.43,30.1 119.39,31.14 v119.39,31.21 119.39,31.28 122.99,34.88 v127.49,34.88
N$15
  Top 0.15: CHG_LED.C 118.42,49.35 R1_BAT.2
N$16
  Top 0.15: R1_BAT.1 117.1,49.35 117.31,49.35 118,50.04 125.48,50.04 126.24,49.28 126.24,48.52 127.07,47.69 127.35,47.69 U5.1
N$17
  Top 0.15: J1.4 88.02,15.97 88.02,15.63 84.07,11.68 75.28,11.68 70.98,15.97 69.53,15.97 EPD_C1.2
N$18
  Top 0.15: R2_BAT.2 125.76,45.75 125.76,46.65 124.79,47.62 U5.5
N$19
  Top 0.15: C4.1 96.67,39.03 96.67,37.65 94.67,35.64 D4.2 94.6,35.64 93.69,35.64 89.82,39.52 89.26,39.52 83.93,44.85 82.2,44.85 D3.1
N$20
  Top 0.15: J1.5 87.6,16.04 87.6,16.46 87.81,16.66 89.75,16.66 89.96,16.46 89.96,15.56 85.8,11.4 75.14,11.4 71.12,15.42 68.56,15.42 68,15.97 EPD_C2.2
N$21  (via drill 0.3)
  Top 0.15: v81.23,14.52 81.09,14.66 81.09,15.97 J1.18 | v86.98,26.01 87.25,26.01 87.74,25.53 EPD_C6.2
  Bottom 0.15: v81.23,14.52 81.44,14.52 82.48,13.48 85.04,13.48 86.49,14.93 86.49,23.87 87.39,24.77 87.39,25.6 v86.98,26.01
N$22  (via drill 0.3)
  Top 0.15: v80.61,15 80.61,15.97 J1.19 | v86.91,24.91 86.22,25.6 EPD_C7.2
  Bottom 0.15: v80.61,15 81.37,15 82.61,13.76 84.9,13.76 86.22,15.07 86.22,24.21 v86.91,24.91
N$23  (via drill 0.3)
  Top 0.15: v84.14,14.24 83.93,14.03 80.95,14.03 80.05,14.93 80.05,15.97 J1.20 | v85.32,24.7 84.55,25.46 EPD_C8.2
  Bottom 0.15: v84.14,14.24 84.14,14.45 85.39,15.7 85.39,24.63 v85.32,24.7
N$24
  Top 0.15: C_DELAY.1 49.72,98.38 46.81,98.38 46.74,98.45 IC1.5
N$25  (via drill 0.3)
  Top 0.15: v79.08,15.21 79.08,15.97 J1.22 | v82.2,24.84 81.51,25.53 EPD_C10.2
  Bottom 0.15: v79.08,15.21 80.19,15.21 80.47,15.49 81.3,15.49 82.61,14.17 83.45,14.17 85.11,15.83 85.11,21.93 v82.2,24.84
N$26  (via drill 0.3)
  Top 0.15: v77.49,16.04 77.97,16.04 J1.24 | v77.91,25.18 78.32,25.18 78.67,25.53 EPD_C12.2
  Bottom 0.15: v77.49,16.04 81.58,16.04 82.89,14.73 83.17,14.73 84.55,16.11 84.55,18.54 v77.91,25.18
N$29  (via drill 0.3)
  Top 0.15: v70.29,66.46 70.57,66.73 71.05,66.73 R_CAPACITOR.1 | v69.94,67.7 69.94,67.91 70.5,68.46 D7.1
  Bottom 0.15: v70.29,66.46 70.29,67.36 v69.94,67.7
PREVGH  (via drill 0.3)
  Top 0.15: v84.76,14.24 84.28,13.76 80.81,13.76 79.57,15 79.57,15.97 J1.21 | v83.72,24.98 83.45,24.98 82.96,25.46 EPD_C9.2 | v91.06,38.89 91.06,39.66 D5.1
  Bottom 0.15: v84.76,14.24 84.76,14.66 85.8,15.7 85.8,24.84 85.45,25.18 | 85.45,25.18 83.93,25.18 v83.72,24.98 | v91.06,38.89 91.06,30.86 85.45,25.25 85.45,25.18
PREVGL  (via drill 0.3)
  Top 0.15: v78.46,15.21 78.53,15.28 78.53,15.97 J1.23 | v80.75,24.91 80.12,25.53 EPD_C11.2 | v85.59,43.81 85.59,44.85 D3.2
  Bottom 0.15: v78.46,15.21 79.01,15.77 81.44,15.77 82.75,14.45 83.31,14.45 84.83,15.97 84.83,20.82 v80.75,24.91 80.75,24.98 85.59,29.82 v85.59,43.81
RESE  (via drill 0.3)
  Top 0.15: v84.9,11.89 88.5,15.49 88.5,15.97 J1.3 | v66.13,12.1 65.51,12.72 Q3.2 | v64.13,10.02 63.36,10.02 R3.1
  Bottom 0.15: v84.9,11.89 84.69,11.89 83.45,10.64 67.59,10.64 v66.13,12.1 66.13,12.03 v64.13,10.02
RESE'
  Top 0.15: R3.2 62.12,9.95 62.12,9.32 63.23,8.22 63.23,8.01 SJ1.2 63.29,8.22 65.44,8.22 R2.2
RESET  (via drill 0.3)
  Top 0.15: v19.25,107.94 19.8,107.38 19.94,107.38 R_RESET.2 | v21.12,109.25 22.02,109.25 22.16,109.11 RESET_BUTTON.4 22.23,109.11 25.69,109.11 RESET_BUTTON.3 | v26.8,107.31 27.56,107.31 C5.1 | v43.7,105.79 43.84,105.65 43.84,98.52 IC1.1 | v24.65,46.58 24.65,43.05 23.61,42.01 11.84,42.01 10.04,43.81 10.04,44.09 U2.3
  Bottom 0.15: v43.7,105.79 28.39,105.79 26.87,107.31 v26.8,107.31 23.13,107.31 21.19,109.25 v21.12,109.25 19.8,107.94 v19.25,107.94 19.25,107.87 15.1,103.71 15.1,56.35 24.65,46.79 v24.65,46.58
RTC_RST  (via drill 0.3)
  Top 0.15: v23.55,62.79 22.71,61.95 22.71,61.68 U2.16 | v67.52,62.79 68.7,63.96 68.7,64.31 U3.4
  Bottom 0.15: v67.52,62.79 v23.55,62.79
RX  (via drill 0.3)
  Top 0.15: v21.74,71.1 12.6,61.95 12.6,61.68 U2.24 | v79.5,85.36 80.33,85.36 80.75,85.78 RX.TP
  Bottom 0.15: v21.74,71.1 60.04,71.1 74.31,85.36 v79.5,85.36
SCK  (via drill 0.3)
  Top 0.15: v83.65,16.8 83.58,16.73 83.58,16.04 J1.13 | v64.82,16.8 64.82,16.6 64.06,15.83 50.97,15.83 47.16,19.64 40.72,19.64 39.47,20.89 SCK.TP 39.47,20.96 39.75,21.24 39.75,29.75 R6.1 39.82,29.82 v40.58,29.82 | v40.79,50.81 44.6,54.61 U1.6 | v39.68,35.64 39.68,34.81 D10.2 | 15.13,45.72 16.97,47.55 v35.66,47.55 | 15.13,45.72 13.85,44.43 13.85,44.16 U2.6 | v3.88,64.38 3.88,90.83 4.57,91.53 5.12,91.53 J4.P5 | 15.13,45.72 v9.56,51.29
  Bottom 0.15: v64.82,16.8 v83.65,16.8 | 40.79,47.41 40.79,36.75 v39.68,35.64 39.68,35.57 40.58,34.67 v40.58,29.82 | 40.79,47.41 v40.79,50.81 | v35.66,47.55 35.87,47.55 36.01,47.41 40.79,47.41 | v3.88,64.38 9.56,58.7 v9.56,51.29
SCL  (via drill 0.3)
  Top 0.15: v164.54,21.44 165.23,20.75 J3.4 | U4.7 138.43,49.63 139.47,49.63 v139.61,49.77 139.61,50.25 139.26,50.6 v136.77,50.6 | v150.83,6.9 150.48,6.55 149.23,6.55 148.54,5.86 148.26,5.86 R2-PINH.1 | v150.13,13.13 150.13,14.03 SENSOR2.4 | v21.74,65.97 17.66,61.88 17.66,61.68 U2.20 | v73.2,55.31 72.85,55.31 72.57,55.03 U3.16
  Bottom 0.15: v139.61,49.77 139.61,46.37 v164.54,21.44 164.54,21.37 153.22,10.05 | v150.83,6.9 150.83,7.66 153.22,10.05 | 153.22,10.05 v150.13,13.13 | v21.74,65.97 70.43,65.97 72.85,68.4 72.85,69.43 73.2,69.78 73.47,69.78 73.82,69.43 73.82,55.93 v73.2,55.31 73.2,55.24 71.95,53.99 71.95,53.44 74.79,50.6 v136.77,50.6
SDA  (via drill 0.3)
  Top 0.15: v23.55,66.53 18.91,61.88 18.91,61.68 U2.19 | v72.44,53.58 72.3,53.71 72.23,53.71 71.33,54.61 71.33,54.96 U3.15 | v139.12,50.11 138.43,50.11 U4.8 | v148.68,15 149.3,14.38 149.3,14.1 SENSOR2.3 | v149.16,5.86 149.93,5.86 R1-PINH.1 | v154.5,19.71 165.23,19.71 J3.3
  Bottom 0.15: v23.55,66.53 68.14,66.53 71.67,70.06 73.61,70.06 74.1,69.57 74.1,55.24 | v72.44,53.58 74.1,55.24 | 149.16,14.45 v149.16,5.86 | 149.16,14.45 148.68,14.93 v148.68,15 139.12,24.56 v139.12,50.11 139.05,50.11 133.93,55.24 74.1,55.24 | v154.5,19.71 149.23,14.45 149.16,14.45
SRC  (via drill 0.3)
  Top 0.15: C4.2 96.67,40.35 95.22,40.35 94.6,39.73 D5.2 94.53,39.73 92.38,39.73 86.56,45.54 81.44,45.54 81.3,45.4 81.3,39.31 81.44,39.17 L1.1 81.44,39.1 v80.05,38.5 | v65.3,15.77 64.89,15.35 64.89,14.93 Q3.3
  Bottom 0.15: v65.3,15.77 63.85,15.77 63.43,16.18 63.43,21.1 v80.05,38.5
SS_SD  (via drill 0.3)
  Top 0.15: 13.61,99.87 14.82,98.66 D8.2 | 13.61,99.87 11.08,102.4 10.87,102.4 R10.1 | v7.62,46.37 9.28,46.37 11.22,44.43 11.22,44.16 U2.4 | v6.51,45.96 6.51,46.17 6.3,46.37 6.3,86.54 | 6.3,86.54 6.3,87.44 5.54,88.2 J4.P2 | v13.23,99.49 13.61,99.87 | v6.16,86.54 6.3,86.54
  Bottom 0.15: v7.62,46.37 6.92,46.37 v6.51,45.96 | v13.23,99.49 6.16,92.42 v6.16,86.54
TX  (via drill 0.3)
  Top 0.15: v20.01,70.61 11.29,61.88 11.29,61.68 U2.25 | v74.44,84.88 75.41,85.85 TX.TP
  Bottom 0.15: v20.01,70.61 60.18,70.61 v74.44,84.88
USB_D+  (via drill 0.3)
  Top 0.15: v149.51,48.38 150.97,48.38 D1.4 | v68.35,40.49 v83.58,55.72 | v23.96,42.98 23.96,44.09 U2.14
  Bottom 0.15: v149.51,48.38 141.62,48.38 134.28,55.72 v83.58,55.72 | v68.35,40.49 60.73,40.49 49.58,29.34 37.6,29.34 v23.96,42.98
USB_D-  (via drill 0.3)
  Top 0.15: v150,49.84 150.41,50.25 150.97,50.25 D1.6 | v23.96,45.27 23.61,45.27 22.71,44.37 22.71,44.16 U2.13
  Bottom 0.15: v150,49.84 140.57,49.84 123.6,66.8 77.28,66.8 73.75,70.33 25.48,70.33 15.37,60.22 15.37,56.48 25.14,46.72 25.14,46.44 v23.96,45.27
VBAT
  Top 0.3: U5.3 127.42,49.56 128.46,50.6 131.09,50.6 C2_BAT.1 131.23,50.53 135.45,50.53 135.59,50.39 135.73,50.32 | U4.2 136.42,49.56 136.42,49.14 U4.3 136.28,49.07 135.94,49.07 | 135.94,49.07 135.66,48.8 135.66,46.1 Q1.3 | 135.73,50.32 138.85,53.44 138.85,63.82 VBAT.TP | 135.73,50.32 135.73,49.35 135.87,49.21 135.94,49.07
VBUS
  Top 0.3: R1_PWRUSB.2 115.37,33.22 117.17,33.22 D2.2 117.45,33.56 117.45,42.84 122.16,47.55 C1_BAT.1 122.23,48.87 | 122.23,48.87 122.23,49.28 CHG_LED.A | 124.79,48.94 129.71,44.02 134.62,44.02 Q1.1 134.76,44.09 135.45,44.09 136.08,44.71 145.36,44.71 | 124.79,48.94 124.79,49.49 U5.4 | 122.23,48.87 124.65,48.87 124.79,48.94 | 150.76,51.36 153.32,51.36 C5_USB.1 | 150.76,51.36 149.44,50.04 149.44,49.84 148.96,49.35 148.61,49.35 D1.2 148.47,49.28 148.13,49.28 147.43,48.59 145.98,48.59 C4_USB.1 145.84,48.45 145.36,47.97 145.36,44.71 | VBUS.TP 142.86,63.76 142.86,59.32 150.69,51.5 150.76,51.36 | 145.36,44.71 145.36,38.2 145.63,37.92 147.29,37.92 149.44,40.07 150.9,40.07 PFMF.050.1.2
VRTC
  Top 0.3: C10_SUPERCAP.1 79.98,56.9 77.84,54.75 76.24,54.75 C8.1 76.04,54.75 74.51,54.75 72.92,56.35 70.64,56.35 | 70.64,56.35 70.64,55.65 70.01,55.03 U3.14 | 70.64,56.35 70.64,65.35 70.91,65.62 71.19,65.62 72.3,66.73 R_CAPACITOR.2
VUSB
  Top 0.3: J2.A4 164.4,51.77 164.4,51.98 J2.B9 164.26,52.05 163.78,52.05 163.5,52.33 | J2.A9 164.4,56.83 164.4,56.55 J2.B4 164.26,56.48 163.71,56.48 163.5,56.28 163.5,52.33 | 163.5,52.33 163.36,52.26 159.76,52.26 147.64,40.14 146.46,40.14 PFMF.050.1.1